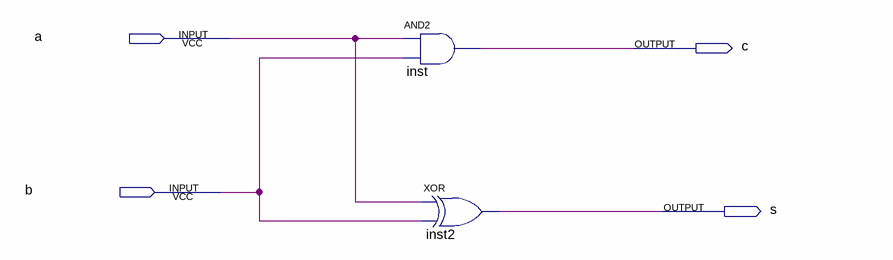
[diagram p0: schematic sheet]
// Quartus schematic ha.bdf as structural Verilog: 2 symbols, 4 pins
module ha (
  input  a,
  input  b,
  output c,
  output s
);

  and inst (c, a, b);
  xor inst2 (s, a, b);
endmodule
